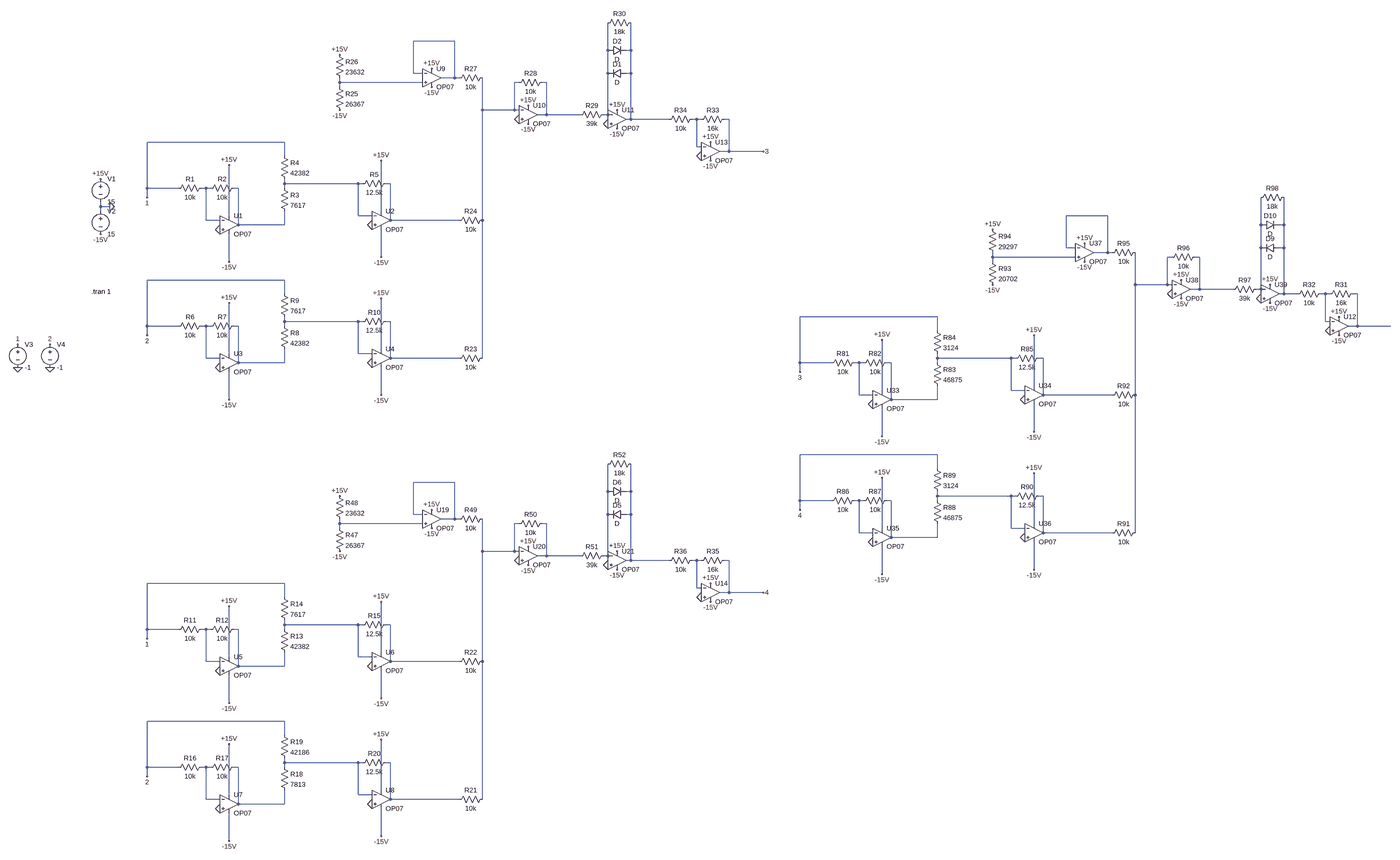
[diagram p0: schematic V4.2 Test.asc, whole sheet]
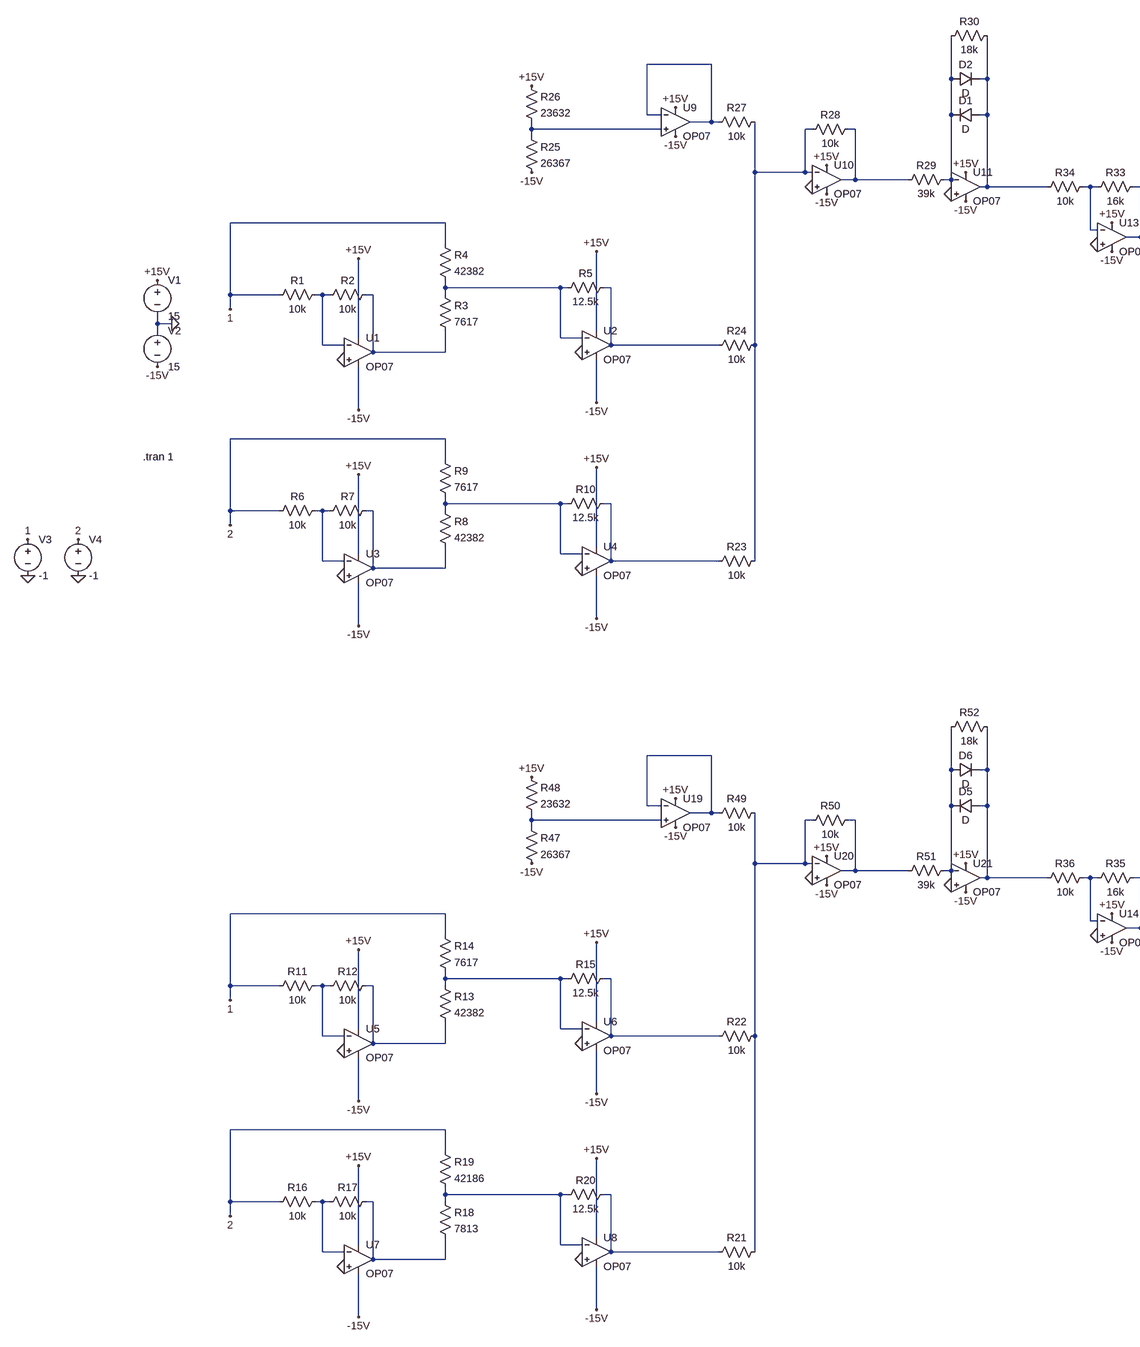
[diagram p1: schematic V4.2 Test.asc, part, row 1 of 1, column 1 of 2]
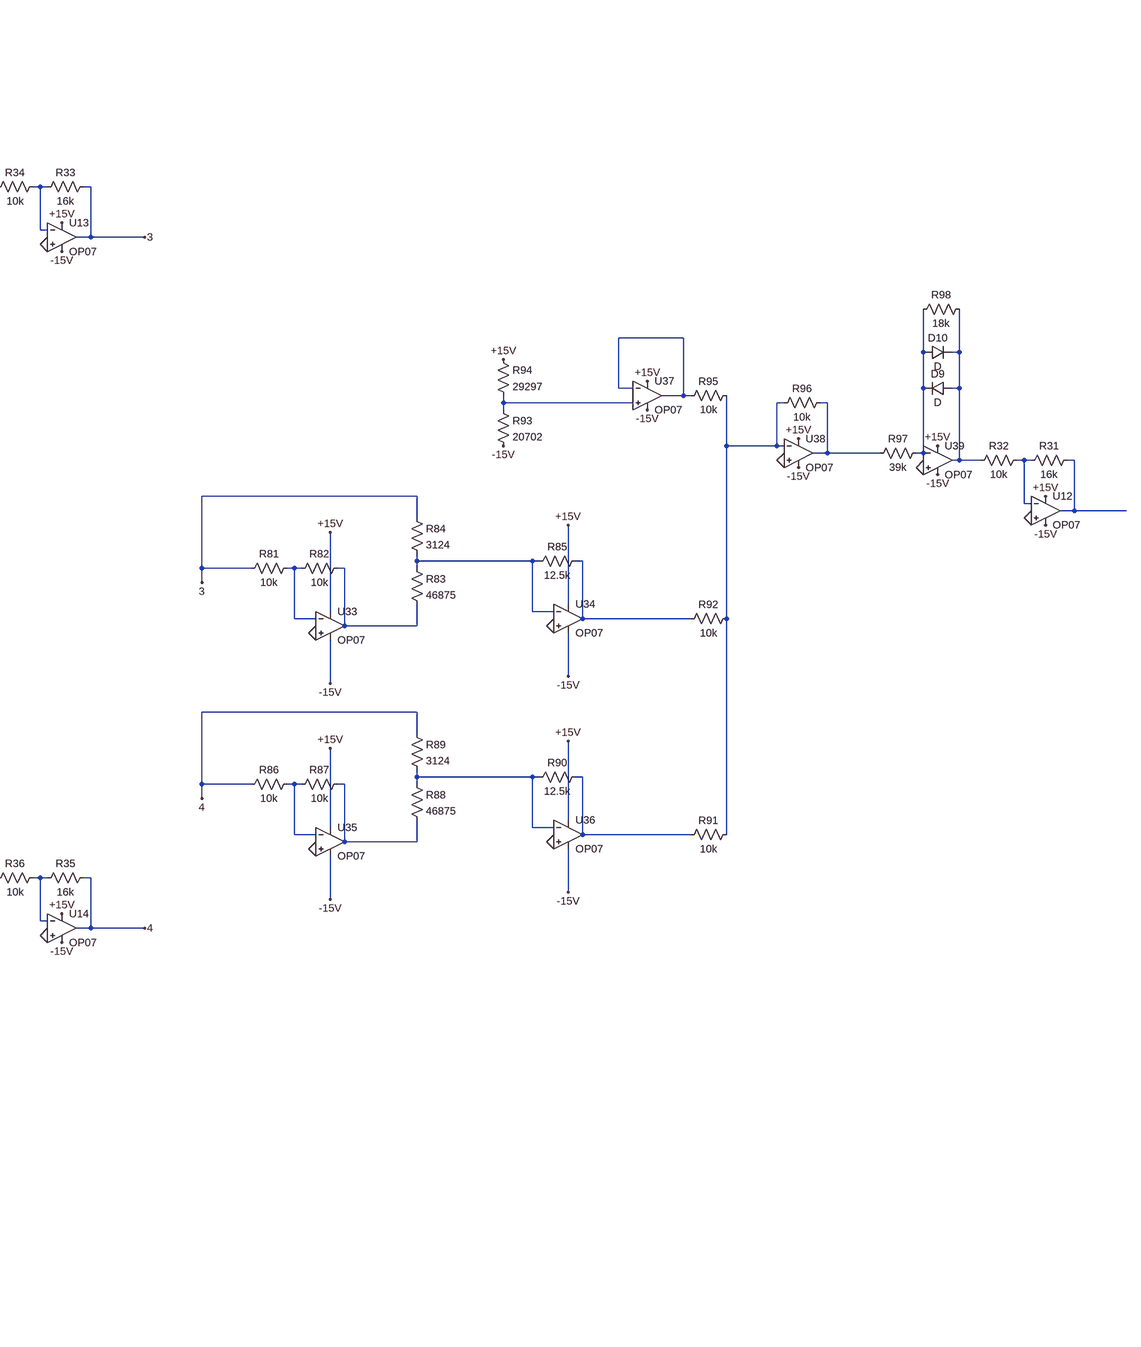
[diagram p2: schematic V4.2 Test.asc, part, row 1 of 1, column 2 of 2]
V4.2 Test.asc, the LTspice schematic file:
Version 4
SHEET 1 8232 2548
WIRE 1472 -416 1328 -416
WIRE 2032 -384 2032 -480
WIRE 2112 -384 2112 -480
WIRE 2112 -384 2096 -384
WIRE 1328 -304 1328 -416
WIRE 1360 -304 1328 -304
WIRE 2032 -304 2032 -384
WIRE 2112 -304 2112 -384
WIRE 2112 -304 2096 -304
WIRE 1472 -288 1472 -416
WIRE 1472 -288 1424 -288
WIRE 1488 -288 1472 -288
WIRE 1072 -272 1072 -288
WIRE 1360 -272 1072 -272
WIRE 1696 -272 1680 -272
WIRE 1792 -272 1776 -272
WIRE 1072 -256 1072 -272
WIRE 1568 -176 1568 -288
WIRE 1680 -176 1680 -272
WIRE 1680 -176 1568 -176
WIRE 1696 -176 1680 -176
WIRE 1792 -160 1792 -272
WIRE 1792 -160 1760 -160
WIRE 1936 -160 1792 -160
WIRE 2032 -160 2032 -304
WIRE 2032 -160 2016 -160
WIRE 2112 -144 2112 -304
WIRE 2112 -144 2096 -144
WIRE 2320 -144 2112 -144
WIRE 2416 -144 2400 -144
WIRE 2432 -144 2416 -144
WIRE 2528 -144 2512 -144
WIRE 880 -64 240 -64
WIRE 2416 -48 2416 -144
WIRE 2432 -48 2416 -48
WIRE 2528 -32 2528 -144
WIRE 2528 -32 2496 -32
WIRE 2656 -32 2528 -32
WIRE 880 -16 880 -64
WIRE 880 80 880 64
WIRE 1136 80 880 80
WIRE 1152 80 1136 80
WIRE 1248 80 1232 80
WIRE 240 96 240 -64
WIRE 416 96 240 96
WIRE 512 96 496 96
WIRE 528 96 512 96
WIRE 624 96 608 96
WIRE 880 96 880 80
WIRE 240 128 240 96
WIRE -32 160 -32 144
WIRE 0 160 -32 160
WIRE -32 176 -32 160
WIRE 1216 176 1216 0
WIRE 592 192 592 16
WIRE 1136 192 1136 80
WIRE 1184 192 1136 192
WIRE 4064 192 3920 192
WIRE 512 208 512 96
WIRE 560 208 512 208
WIRE 1248 208 1248 80
WIRE 1488 208 1248 208
WIRE 1568 208 1568 -176
WIRE 624 224 624 96
WIRE 880 224 880 176
WIRE 880 224 624 224
WIRE 4624 224 4624 128
WIRE 4704 224 4704 128
WIRE 4704 224 4688 224
WIRE 3920 304 3920 192
WIRE 3952 304 3920 304
WIRE 4624 304 4624 224
WIRE 4704 304 4704 224
WIRE 4704 304 4688 304
WIRE 4064 320 4064 192
WIRE 4064 320 4016 320
WIRE 4080 320 4064 320
WIRE 1216 336 1216 240
WIRE 3664 336 3664 320
WIRE 3952 336 3664 336
WIRE 4288 336 4272 336
WIRE 4384 336 4368 336
WIRE 592 352 592 256
WIRE 3664 352 3664 336
WIRE 880 416 240 416
WIRE 4160 432 4160 320
WIRE 4272 432 4272 336
WIRE 4272 432 4160 432
WIRE 4288 432 4272 432
WIRE 4384 448 4384 336
WIRE 4384 448 4352 448
WIRE 4528 448 4384 448
WIRE 4624 448 4624 304
WIRE 4624 448 4608 448
WIRE 880 464 880 416
WIRE 4704 464 4704 304
WIRE 4704 464 4688 464
WIRE 4752 464 4704 464
WIRE 4848 464 4832 464
WIRE 4864 464 4848 464
WIRE 4960 464 4944 464
WIRE 3472 544 2832 544
WIRE 880 560 880 544
WIRE 1136 560 880 560
WIRE 1152 560 1136 560
WIRE 1248 560 1232 560
WIRE 4848 560 4848 464
WIRE 4864 560 4848 560
WIRE 240 576 240 416
WIRE 416 576 240 576
WIRE 512 576 496 576
WIRE 528 576 512 576
WIRE 624 576 608 576
WIRE 880 576 880 560
WIRE 4960 576 4960 464
WIRE 4960 576 4928 576
WIRE 5136 576 4960 576
WIRE 3472 592 3472 544
WIRE 240 608 240 576
WIRE 1216 656 1216 480
WIRE 592 672 592 496
WIRE 1136 672 1136 560
WIRE 1184 672 1136 672
WIRE 512 688 512 576
WIRE 560 688 512 688
WIRE 1248 688 1248 560
WIRE 1488 688 1248 688
WIRE 1568 688 1568 208
WIRE 3472 688 3472 672
WIRE 3728 688 3472 688
WIRE 3744 688 3728 688
WIRE 3840 688 3824 688
WIRE 624 704 624 576
WIRE 880 704 880 656
WIRE 880 704 624 704
WIRE 2832 704 2832 544
WIRE 3008 704 2832 704
WIRE 3104 704 3088 704
WIRE 3120 704 3104 704
WIRE 3216 704 3200 704
WIRE 3472 704 3472 688
WIRE 2832 736 2832 704
WIRE 3808 784 3808 608
WIRE 3184 800 3184 624
WIRE 3728 800 3728 688
WIRE 3776 800 3728 800
WIRE 1216 816 1216 720
WIRE 3104 816 3104 704
WIRE 3152 816 3104 816
WIRE 3840 816 3840 688
WIRE 4080 816 3840 816
WIRE 4160 816 4160 432
WIRE 592 832 592 736
WIRE 3216 832 3216 704
WIRE 3472 832 3472 784
WIRE 3472 832 3216 832
WIRE 3808 944 3808 848
WIRE 3184 960 3184 864
WIRE 3472 1024 2832 1024
WIRE 3472 1072 3472 1024
WIRE 1472 1120 1328 1120
WIRE 2032 1152 2032 1056
WIRE 2112 1152 2112 1056
WIRE 2112 1152 2096 1152
WIRE 3472 1168 3472 1152
WIRE 3728 1168 3472 1168
WIRE 3744 1168 3728 1168
WIRE 3840 1168 3824 1168
WIRE 2832 1184 2832 1024
WIRE 3008 1184 2832 1184
WIRE 3104 1184 3088 1184
WIRE 3120 1184 3104 1184
WIRE 3216 1184 3200 1184
WIRE 3472 1184 3472 1168
WIRE 2832 1216 2832 1184
WIRE 1328 1232 1328 1120
WIRE 1360 1232 1328 1232
WIRE 2032 1232 2032 1152
WIRE 2112 1232 2112 1152
WIRE 2112 1232 2096 1232
WIRE 1472 1248 1472 1120
WIRE 1472 1248 1424 1248
WIRE 1488 1248 1472 1248
WIRE 1072 1264 1072 1248
WIRE 1360 1264 1072 1264
WIRE 1696 1264 1680 1264
WIRE 1792 1264 1776 1264
WIRE 3808 1264 3808 1088
WIRE 1072 1280 1072 1264
WIRE 3184 1280 3184 1104
WIRE 3728 1280 3728 1168
WIRE 3776 1280 3728 1280
WIRE 3104 1296 3104 1184
WIRE 3152 1296 3104 1296
WIRE 3840 1296 3840 1168
WIRE 4080 1296 3840 1296
WIRE 4160 1296 4160 816
WIRE 3216 1312 3216 1184
WIRE 3472 1312 3472 1264
WIRE 3472 1312 3216 1312
WIRE 1568 1360 1568 1248
WIRE 1680 1360 1680 1264
WIRE 1680 1360 1568 1360
WIRE 1696 1360 1680 1360
WIRE 1792 1376 1792 1264
WIRE 1792 1376 1760 1376
WIRE 1936 1376 1792 1376
WIRE 2032 1376 2032 1232
WIRE 2032 1376 2016 1376
WIRE 2112 1392 2112 1232
WIRE 2112 1392 2096 1392
WIRE 2320 1392 2112 1392
WIRE 2416 1392 2400 1392
WIRE 2432 1392 2416 1392
WIRE 2528 1392 2512 1392
WIRE 3808 1424 3808 1328
WIRE 3184 1440 3184 1344
WIRE 880 1472 240 1472
WIRE 2416 1488 2416 1392
WIRE 2432 1488 2416 1488
WIRE 2528 1504 2528 1392
WIRE 2528 1504 2496 1504
WIRE 2656 1504 2528 1504
WIRE 880 1520 880 1472
WIRE 880 1616 880 1600
WIRE 1136 1616 880 1616
WIRE 1152 1616 1136 1616
WIRE 1248 1616 1232 1616
WIRE 240 1632 240 1472
WIRE 416 1632 240 1632
WIRE 512 1632 496 1632
WIRE 528 1632 512 1632
WIRE 624 1632 608 1632
WIRE 880 1632 880 1616
WIRE 240 1664 240 1632
WIRE 1216 1712 1216 1536
WIRE 592 1728 592 1552
WIRE 1136 1728 1136 1616
WIRE 1184 1728 1136 1728
WIRE 512 1744 512 1632
WIRE 560 1744 512 1744
WIRE 1248 1744 1248 1616
WIRE 1488 1744 1248 1744
WIRE 1568 1744 1568 1360
WIRE 624 1760 624 1632
WIRE 880 1760 880 1712
WIRE 880 1760 624 1760
WIRE 1216 1872 1216 1776
WIRE 592 1888 592 1792
WIRE 880 1952 240 1952
WIRE 880 2000 880 1952
WIRE 880 2096 880 2080
WIRE 1136 2096 880 2096
WIRE 1152 2096 1136 2096
WIRE 1248 2096 1232 2096
WIRE 240 2112 240 1952
WIRE 416 2112 240 2112
WIRE 512 2112 496 2112
WIRE 528 2112 512 2112
WIRE 624 2112 608 2112
WIRE 880 2112 880 2096
WIRE 240 2144 240 2112
WIRE 1216 2192 1216 2016
WIRE 592 2208 592 2032
WIRE 1136 2208 1136 2096
WIRE 1184 2208 1136 2208
WIRE 512 2224 512 2112
WIRE 560 2224 512 2224
WIRE 1248 2224 1248 2096
WIRE 1488 2224 1248 2224
WIRE 1568 2224 1568 1744
WIRE 624 2240 624 2112
WIRE 880 2240 880 2192
WIRE 880 2240 624 2240
WIRE 1216 2352 1216 2256
WIRE 592 2368 592 2272
FLAG 0 160 0
FLAG -32 64 +15V
FLAG -32 256 -15V
FLAG 592 16 +15V
FLAG 592 352 -15V
FLAG 560 240 0
FLAG 1216 0 +15V
FLAG 1216 336 -15V
FLAG 1184 224 0
FLAG 592 496 +15V
FLAG 592 832 -15V
FLAG 560 720 0
FLAG 1216 480 +15V
FLAG 1216 816 -15V
FLAG 1184 704 0
FLAG 1072 -368 +15V
FLAG 1072 -176 -15V
FLAG 1392 -320 +15V
FLAG 1392 -256 -15V
FLAG 1728 -192 +15V
FLAG 1728 -128 -15V
FLAG 1696 -144 0
FLAG 2064 -176 +15V
FLAG 2064 -112 -15V
FLAG 2032 -128 0
FLAG 592 1552 +15V
FLAG 592 1888 -15V
FLAG 560 1776 0
FLAG 1216 1536 +15V
FLAG 1216 1872 -15V
FLAG 1184 1760 0
FLAG 592 2032 +15V
FLAG 592 2368 -15V
FLAG 560 2256 0
FLAG 1216 2016 +15V
FLAG 1216 2352 -15V
FLAG 1184 2240 0
FLAG 1072 1168 +15V
FLAG 1072 1360 -15V
FLAG 1392 1216 +15V
FLAG 1392 1280 -15V
FLAG 1728 1344 +15V
FLAG 1728 1408 -15V
FLAG 1696 1392 0
FLAG 2064 1360 +15V
FLAG 2064 1424 -15V
FLAG 2032 1408 0
FLAG 3184 624 +15V
FLAG 3184 960 -15V
FLAG 3152 848 0
FLAG 3808 608 +15V
FLAG 3808 944 -15V
FLAG 3776 832 0
FLAG 3184 1104 +15V
FLAG 3184 1440 -15V
FLAG 3152 1328 0
FLAG 3808 1088 +15V
FLAG 3808 1424 -15V
FLAG 3776 1312 0
FLAG 3664 240 +15V
FLAG 3664 432 -15V
FLAG 3984 288 +15V
FLAG 3984 352 -15V
FLAG 4320 416 +15V
FLAG 4320 480 -15V
FLAG 4288 464 0
FLAG 4656 432 +15V
FLAG 4656 496 -15V
FLAG 4624 480 0
FLAG 240 128 1
FLAG 240 608 2
FLAG 240 1664 1
FLAG 240 2144 2
FLAG 2656 -32 3
FLAG 2656 1504 4
FLAG 2832 736 3
FLAG 2832 1216 4
FLAG -208 720 0
FLAG -320 720 0
FLAG -320 640 1
FLAG -208 640 2
FLAG 2464 -64 +15V
FLAG 2464 0 -15V
FLAG 2432 -16 0
FLAG 2464 1472 +15V
FLAG 2464 1536 -15V
FLAG 2432 1520 0
FLAG 4896 544 +15V
FLAG 4896 608 -15V
FLAG 4864 592 0
DATAFLAG 864 -64 ""
DATAFLAG 864 224 ""
DATAFLAG 976 80 ""
DATAFLAG 1360 208 ""
DATAFLAG 864 416 ""
DATAFLAG 864 704 ""
DATAFLAG 976 560 ""
DATAFLAG 1360 688 ""
DATAFLAG 1872 -160 ""
DATAFLAG 1232 -272 ""
DATAFLAG 864 1472 ""
DATAFLAG 864 1760 ""
DATAFLAG 976 1616 ""
DATAFLAG 1360 1744 ""
DATAFLAG 864 1952 ""
DATAFLAG 864 2240 ""
DATAFLAG 976 2096 ""
DATAFLAG 1360 2224 ""
DATAFLAG 1872 1376 ""
DATAFLAG 1232 1264 ""
DATAFLAG 3456 544 ""
DATAFLAG 3456 832 ""
DATAFLAG 3568 688 ""
DATAFLAG 3952 816 ""
DATAFLAG 3456 1024 ""
DATAFLAG 3456 1312 ""
DATAFLAG 3568 1168 ""
DATAFLAG 3952 1296 ""
DATAFLAG 4464 448 ""
DATAFLAG 3824 336 ""
DATAFLAG 2640 -32 ""
DATAFLAG 2640 1504 ""
DATAFLAG 5104 576 ""
SYMBOL voltage -32 48 R0
WINDOW 123 0 0 Left 0
WINDOW 39 0 0 Left 0
SYMATTR InstName V1
SYMATTR Value 15
SYMBOL voltage -32 160 R0
WINDOW 123 0 0 Left 0
WINDOW 39 0 0 Left 0
SYMATTR InstName V2
SYMATTR Value 15
SYMBOL res 512 80 R90
WINDOW 0 0 56 VBottom 2
WINDOW 3 32 56 VTop 2
SYMATTR InstName R1
SYMATTR Value 10k
SYMBOL res 624 80 R90
WINDOW 0 0 56 VBottom 2
WINDOW 3 32 56 VTop 2
SYMATTR InstName R2
SYMATTR Value 10k
SYMBOL OpAmps\\OP07 592 160 R0
SYMATTR InstName U1
SYMBOL res 864 80 R0
SYMATTR InstName R3
SYMATTR Value 7617
SYMBOL res 864 -32 R0
SYMATTR InstName R4
SYMATTR Value 42382
SYMBOL res 1248 64 R90
WINDOW 0 0 56 VBottom 2
WINDOW 3 32 56 VTop 2
SYMATTR InstName R5
SYMATTR Value 12.5k
SYMBOL OpAmps\\OP07 1216 144 R0
SYMATTR InstName U2
SYMBOL res 512 560 R90
WINDOW 0 0 56 VBottom 2
WINDOW 3 32 56 VTop 2
SYMATTR InstName R6
SYMATTR Value 10k
SYMBOL res 624 560 R90
WINDOW 0 0 56 VBottom 2
WINDOW 3 32 56 VTop 2
SYMATTR InstName R7
SYMATTR Value 10k
SYMBOL OpAmps\\OP07 592 640 R0
SYMATTR InstName U3
SYMBOL res 864 560 R0
SYMATTR InstName R8
SYMATTR Value 42382
SYMBOL res 864 448 R0
SYMATTR InstName R9
SYMATTR Value 7617
SYMBOL res 1248 544 R90
WINDOW 0 0 56 VBottom 2
WINDOW 3 32 56 VTop 2
SYMATTR InstName R10
SYMATTR Value 12.5k
SYMBOL OpAmps\\OP07 1216 624 R0
SYMATTR InstName U4
SYMBOL res 1584 672 R90
WINDOW 0 0 56 VBottom 2
WINDOW 3 32 56 VTop 2
SYMATTR InstName R23
SYMATTR Value 10k
SYMBOL res 1584 192 R90
WINDOW 0 0 56 VBottom 2
WINDOW 3 32 56 VTop 2
SYMATTR InstName R24
SYMATTR Value 10k
SYMBOL res 1056 -272 R0
SYMATTR InstName R25
SYMATTR Value 26367
SYMBOL res 1056 -384 R0
SYMATTR InstName R26
SYMATTR Value 23632
SYMBOL OpAmps\\OP07 1392 -352 R0
SYMATTR InstName U9
SYMBOL res 1584 -304 R90
WINDOW 0 0 56 VBottom 2
WINDOW 3 32 56 VTop 2
SYMATTR InstName R27
SYMATTR Value 10k
SYMBOL OpAmps\\OP07 1728 -224 R0
SYMATTR InstName U10
SYMBOL res 1792 -288 R90
WINDOW 0 0 56 VBottom 2
WINDOW 3 32 56 VTop 2
SYMATTR InstName R28
SYMATTR Value 10k
SYMBOL res 2032 -176 R90
WINDOW 0 0 56 VBottom 2
WINDOW 3 32 56 VTop 2
SYMATTR InstName R29
SYMATTR Value 39k
SYMBOL OpAmps\\OP07 2064 -208 R0
SYMATTR InstName U11
SYMBOL diode 2096 -320 R90
WINDOW 0 0 32 VBottom 2
WINDOW 3 32 32 VTop 2
SYMATTR InstName D1
SYMBOL diode 2032 -368 R270
WINDOW 0 32 32 VTop 2
WINDOW 3 0 32 VBottom 2
SYMATTR InstName D2
SYMBOL res 2128 -496 R90
WINDOW 0 0 56 VBottom 2
WINDOW 3 32 56 VTop 2
SYMATTR InstName R30
SYMATTR Value 18k
SYMBOL res 512 1616 R90
WINDOW 0 0 56 VBottom 2
WINDOW 3 32 56 VTop 2
SYMATTR InstName R11
SYMATTR Value 10k
SYMBOL res 624 1616 R90
WINDOW 0 0 56 VBottom 2
WINDOW 3 32 56 VTop 2
SYMATTR InstName R12
SYMATTR Value 10k
SYMBOL OpAmps\\OP07 592 1696 R0
SYMATTR InstName U5
SYMBOL res 864 1616 R0
SYMATTR InstName R13
SYMATTR Value 42382
SYMBOL res 864 1504 R0
SYMATTR InstName R14
SYMATTR Value 7617
SYMBOL res 1248 1600 R90
WINDOW 0 0 56 VBottom 2
WINDOW 3 32 56 VTop 2
SYMATTR InstName R15
SYMATTR Value 12.5k
SYMBOL OpAmps\\OP07 1216 1680 R0
SYMATTR InstName U6
SYMBOL res 512 2096 R90
WINDOW 0 0 56 VBottom 2
WINDOW 3 32 56 VTop 2
SYMATTR InstName R16
SYMATTR Value 10k
SYMBOL res 624 2096 R90
WINDOW 0 0 56 VBottom 2
WINDOW 3 32 56 VTop 2
SYMATTR InstName R17
SYMATTR Value 10k
SYMBOL OpAmps\\OP07 592 2176 R0
SYMATTR InstName U7
SYMBOL res 864 2096 R0
SYMATTR InstName R18
SYMATTR Value 7813
SYMBOL res 864 1984 R0
SYMATTR InstName R19
SYMATTR Value 42186
SYMBOL res 1248 2080 R90
WINDOW 0 0 56 VBottom 2
WINDOW 3 32 56 VTop 2
SYMATTR InstName R20
SYMATTR Value 12.5k
SYMBOL OpAmps\\OP07 1216 2160 R0
SYMATTR InstName U8
SYMBOL res 1584 2208 R90
WINDOW 0 0 56 VBottom 2
WINDOW 3 32 56 VTop 2
SYMATTR InstName R21
SYMATTR Value 10k
SYMBOL res 1584 1728 R90
WINDOW 0 0 56 VBottom 2
WINDOW 3 32 56 VTop 2
SYMATTR InstName R22
SYMATTR Value 10k
SYMBOL res 1056 1264 R0
SYMATTR InstName R47
SYMATTR Value 26367
SYMBOL res 1056 1152 R0
SYMATTR InstName R48
SYMATTR Value 23632
SYMBOL OpAmps\\OP07 1392 1184 R0
SYMATTR InstName U19
SYMBOL res 1584 1232 R90
WINDOW 0 0 56 VBottom 2
WINDOW 3 32 56 VTop 2
SYMATTR InstName R49
SYMATTR Value 10k
SYMBOL OpAmps\\OP07 1728 1312 R0
SYMATTR InstName U20
SYMBOL res 1792 1248 R90
WINDOW 0 0 56 VBottom 2
WINDOW 3 32 56 VTop 2
SYMATTR InstName R50
SYMATTR Value 10k
SYMBOL res 2032 1360 R90
WINDOW 0 0 56 VBottom 2
WINDOW 3 32 56 VTop 2
SYMATTR InstName R51
SYMATTR Value 39k
SYMBOL OpAmps\\OP07 2064 1328 R0
SYMATTR InstName U21
SYMBOL diode 2096 1216 R90
WINDOW 0 0 32 VBottom 2
WINDOW 3 32 32 VTop 2
SYMATTR InstName D5
SYMBOL diode 2032 1168 R270
WINDOW 0 32 32 VTop 2
WINDOW 3 0 32 VBottom 2
SYMATTR InstName D6
SYMBOL res 2128 1040 R90
WINDOW 0 0 56 VBottom 2
WINDOW 3 32 56 VTop 2
SYMATTR InstName R52
SYMATTR Value 18k
SYMBOL res 3104 688 R90
WINDOW 0 0 56 VBottom 2
WINDOW 3 32 56 VTop 2
SYMATTR InstName R81
SYMATTR Value 10k
SYMBOL res 3216 688 R90
WINDOW 0 0 56 VBottom 2
WINDOW 3 32 56 VTop 2
SYMATTR InstName R82
SYMATTR Value 10k
SYMBOL OpAmps\\OP07 3184 768 R0
SYMATTR InstName U33
SYMBOL res 3456 688 R0
SYMATTR InstName R83
SYMATTR Value 46875
SYMBOL res 3456 576 R0
SYMATTR InstName R84
SYMATTR Value 3124
SYMBOL res 3840 672 R90
WINDOW 0 0 56 VBottom 2
WINDOW 3 32 56 VTop 2
SYMATTR InstName R85
SYMATTR Value 12.5k
SYMBOL OpAmps\\OP07 3808 752 R0
SYMATTR InstName U34
SYMBOL res 3104 1168 R90
WINDOW 0 0 56 VBottom 2
WINDOW 3 32 56 VTop 2
SYMATTR InstName R86
SYMATTR Value 10k
SYMBOL res 3216 1168 R90
WINDOW 0 0 56 VBottom 2
WINDOW 3 32 56 VTop 2
SYMATTR InstName R87
SYMATTR Value 10k
SYMBOL OpAmps\\OP07 3184 1248 R0
SYMATTR InstName U35
SYMBOL res 3456 1168 R0
SYMATTR InstName R88
SYMATTR Value 46875
SYMBOL res 3456 1056 R0
SYMATTR InstName R89
SYMATTR Value 3124
SYMBOL res 3840 1152 R90
WINDOW 0 0 56 VBottom 2
WINDOW 3 32 56 VTop 2
SYMATTR InstName R90
SYMATTR Value 12.5k
SYMBOL OpAmps\\OP07 3808 1232 R0
SYMATTR InstName U36
SYMBOL res 4176 1280 R90
WINDOW 0 0 56 VBottom 2
WINDOW 3 32 56 VTop 2
SYMATTR InstName R91
SYMATTR Value 10k
SYMBOL res 4176 800 R90
WINDOW 0 0 56 VBottom 2
WINDOW 3 32 56 VTop 2
SYMATTR InstName R92
SYMATTR Value 10k
SYMBOL res 3648 336 R0
SYMATTR InstName R93
SYMATTR Value 20702
SYMBOL res 3648 224 R0
SYMATTR InstName R94
SYMATTR Value 29297
SYMBOL OpAmps\\OP07 3984 256 R0
SYMATTR InstName U37
SYMBOL res 4176 304 R90
WINDOW 0 0 56 VBottom 2
WINDOW 3 32 56 VTop 2
SYMATTR InstName R95
SYMATTR Value 10k
SYMBOL OpAmps\\OP07 4320 384 R0
SYMATTR InstName U38
SYMBOL res 4384 320 R90
WINDOW 0 0 56 VBottom 2
WINDOW 3 32 56 VTop 2
SYMATTR InstName R96
SYMATTR Value 10k
SYMBOL res 4624 432 R90
WINDOW 0 0 56 VBottom 2
WINDOW 3 32 56 VTop 2
SYMATTR InstName R97
SYMATTR Value 39k
SYMBOL OpAmps\\OP07 4656 400 R0
SYMATTR InstName U39
SYMBOL diode 4688 288 R90
WINDOW 0 0 32 VBottom 2
WINDOW 3 32 32 VTop 2
SYMATTR InstName D9
SYMBOL diode 4624 240 R270
WINDOW 0 32 32 VTop 2
WINDOW 3 0 32 VBottom 2
SYMATTR InstName D10
SYMBOL res 4720 112 R90
WINDOW 0 0 56 VBottom 2
WINDOW 3 32 56 VTop 2
SYMATTR InstName R98
SYMATTR Value 18k
SYMBOL voltage -320 624 R0
WINDOW 123 0 0 Left 0
WINDOW 39 0 0 Left 0
SYMATTR InstName V3
SYMATTR Value -1
SYMBOL voltage -208 624 R0
WINDOW 123 0 0 Left 0
WINDOW 39 0 0 Left 0
SYMATTR InstName V4
SYMATTR Value -1
SYMBOL OpAmps\\OP07 2464 -96 R0
SYMATTR InstName U13
SYMBOL res 2528 -160 R90
WINDOW 0 0 56 VBottom 2
WINDOW 3 32 56 VTop 2
SYMATTR InstName R33
SYMATTR Value 16k
SYMBOL res 2416 -160 R90
WINDOW 0 0 56 VBottom 2
WINDOW 3 32 56 VTop 2
SYMATTR InstName R34
SYMATTR Value 10k
SYMBOL OpAmps\\OP07 2464 1440 R0
SYMATTR InstName U14
SYMBOL res 2528 1376 R90
WINDOW 0 0 56 VBottom 2
WINDOW 3 32 56 VTop 2
SYMATTR InstName R35
SYMATTR Value 16k
SYMBOL res 2416 1376 R90
WINDOW 0 0 56 VBottom 2
WINDOW 3 32 56 VTop 2
SYMATTR InstName R36
SYMATTR Value 10k
SYMBOL OpAmps\\OP07 4896 512 R0
SYMATTR InstName U12
SYMBOL res 4960 448 R90
WINDOW 0 0 56 VBottom 2
WINDOW 3 32 56 VTop 2
SYMATTR InstName R31
SYMATTR Value 16k
SYMBOL res 4848 448 R90
WINDOW 0 0 56 VBottom 2
WINDOW 3 32 56 VTop 2
SYMATTR InstName R32
SYMATTR Value 10k
TEXT -64 456 Left 2 !.tran 1

The netlist it stands for:
* V4.2 Test.asc
V1 +15V 0 15
V2 0 -15V 15
R1 N010 1 10k
R2 N011 N010 10k
XU1 0 N010 +15V -15V N011 LT1001  ; OP07, pins In+ In- V+ V- OUT
R3 N008 N011 7617
R4 1 N008 42382
R5 N009 N008 12.5k
XU2 0 N008 +15V -15V N009 LT1001  ; OP07, pins In+ In- V+ V- OUT
R6 N022 2 10k
R7 N023 N022 10k
XU3 0 N022 +15V -15V N023 LT1001  ; OP07, pins In+ In- V+ V- OUT
R8 N020 N023 42382
R9 2 N020 7617
R10 N021 N020 12.5k
XU4 0 N020 +15V -15V N021 LT1001  ; OP07, pins In+ In- V+ V- OUT
R23 N005 N021 10k
R24 N005 N009 10k
R25 N004 -15V 26367
R26 +15V N004 23632
XU9 N004 N001 +15V -15V N001 LT1001  ; OP07, pins In+ In- V+ V- OUT
R27 N005 N001 10k
XU10 0 N005 +15V -15V N006 LT1001  ; OP07, pins In+ In- V+ V- OUT
R28 N006 N005 10k
R29 N002 N006 39k
XU11 0 N002 +15V -15V N003 LT1001  ; OP07, pins In+ In- V+ V- OUT
D1 N003 N002 D
D2 N002 N003 D
R30 N003 N002 18k
R11 N041 1 10k
R12 N042 N041 10k
XU5 0 N041 +15V -15V N042 LT1001  ; OP07, pins In+ In- V+ V- OUT
R13 N039 N042 42382
R14 1 N039 7617
R15 N040 N039 12.5k
XU6 0 N039 +15V -15V N040 LT1001  ; OP07, pins In+ In- V+ V- OUT
R16 N045 2 10k
R17 N046 N045 10k
XU7 0 N045 +15V -15V N046 LT1001  ; OP07, pins In+ In- V+ V- OUT
R18 N043 N046 7813
R19 2 N043 42186
R20 N044 N043 12.5k
XU8 0 N043 +15V -15V N044 LT1001  ; OP07, pins In+ In- V+ V- OUT
R21 N036 N044 10k
R22 N036 N040 10k
R47 N035 -15V 26367
R48 +15V N035 23632
XU19 N035 N028 +15V -15V N028 LT1001  ; OP07, pins In+ In- V+ V- OUT
R49 N036 N028 10k
XU20 0 N036 +15V -15V N037 LT1001  ; OP07, pins In+ In- V+ V- OUT
R50 N037 N036 10k
R51 N029 N037 39k
XU21 0 N029 +15V -15V N030 LT1001  ; OP07, pins In+ In- V+ V- OUT
D5 N030 N029 D
D6 N029 N030 D
R52 N030 N029 18k
R81 N026 3 10k
R82 N027 N026 10k
XU33 0 N026 +15V -15V N027 LT1001  ; OP07, pins In+ In- V+ V- OUT
R83 N024 N027 46875
R84 3 N024 3124
R85 N025 N024 12.5k
XU34 0 N024 +15V -15V N025 LT1001  ; OP07, pins In+ In- V+ V- OUT
R86 N033 4 10k
R87 N034 N033 10k
XU35 0 N033 +15V -15V N034 LT1001  ; OP07, pins In+ In- V+ V- OUT
R88 N031 N034 46875
R89 4 N031 3124
R90 N032 N031 12.5k
XU36 0 N031 +15V -15V N032 LT1001  ; OP07, pins In+ In- V+ V- OUT
R91 N016 N032 10k
R92 N016 N025 10k
R93 N015 -15V 20702
R94 +15V N015 29297
XU37 N015 N012 +15V -15V N012 LT1001  ; OP07, pins In+ In- V+ V- OUT
R95 N016 N012 10k
XU38 0 N016 +15V -15V N017 LT1001  ; OP07, pins In+ In- V+ V- OUT
R96 N017 N016 10k
R97 N013 N017 39k
XU39 0 N013 +15V -15V N014 LT1001  ; OP07, pins In+ In- V+ V- OUT
D9 N014 N013 D
D10 N013 N014 D
R98 N014 N013 18k
V3 1 0 -1
V4 2 0 -1
XU13 0 N007 +15V -15V 3 LT1001  ; OP07, pins In+ In- V+ V- OUT
R33 3 N007 16k
R34 N007 N003 10k
XU14 0 N038 +15V -15V 4 LT1001  ; OP07, pins In+ In- V+ V- OUT
R35 4 N038 16k
R36 N038 N030 10k
XU12 0 N018 +15V -15V N019 LT1001  ; OP07, pins In+ In- V+ V- OUT
R31 N019 N018 16k
R32 N018 N014 10k
.model D D
.lib standard.dio
.tran 1
.lib LTC.lib
.backanno
.end